# Altium schematic sheet MAKKI_ISMAIL_ESPS3_CAM_0.SchDoc: MAKKI_ISMAIL_ESPS3_CAM
size 370 x 255 mm; COMPANY: ADAFRUIT INDUSTRIES; DRAWN: KTOWN; REV: B; Origin: Eagle; OriginPath: C:\Users\aliam\OneDrive\Desktop\MAKKI_ISMAIL_ESPS3_CAM\MAKKI_ISMAIL_ESPS3_CAM\MAKKI_ISMAIL_ESPS3_CAM.sch; OriginSheet: 1; Date: 1/28/2026 8:50:00 AM; SheetNumber: 1; GateName_1: G$1; SymbolName_1: A4L-LOC; LibraryName: frames; DeviceSetName: A4L-LOC; Sheet: Sheet:
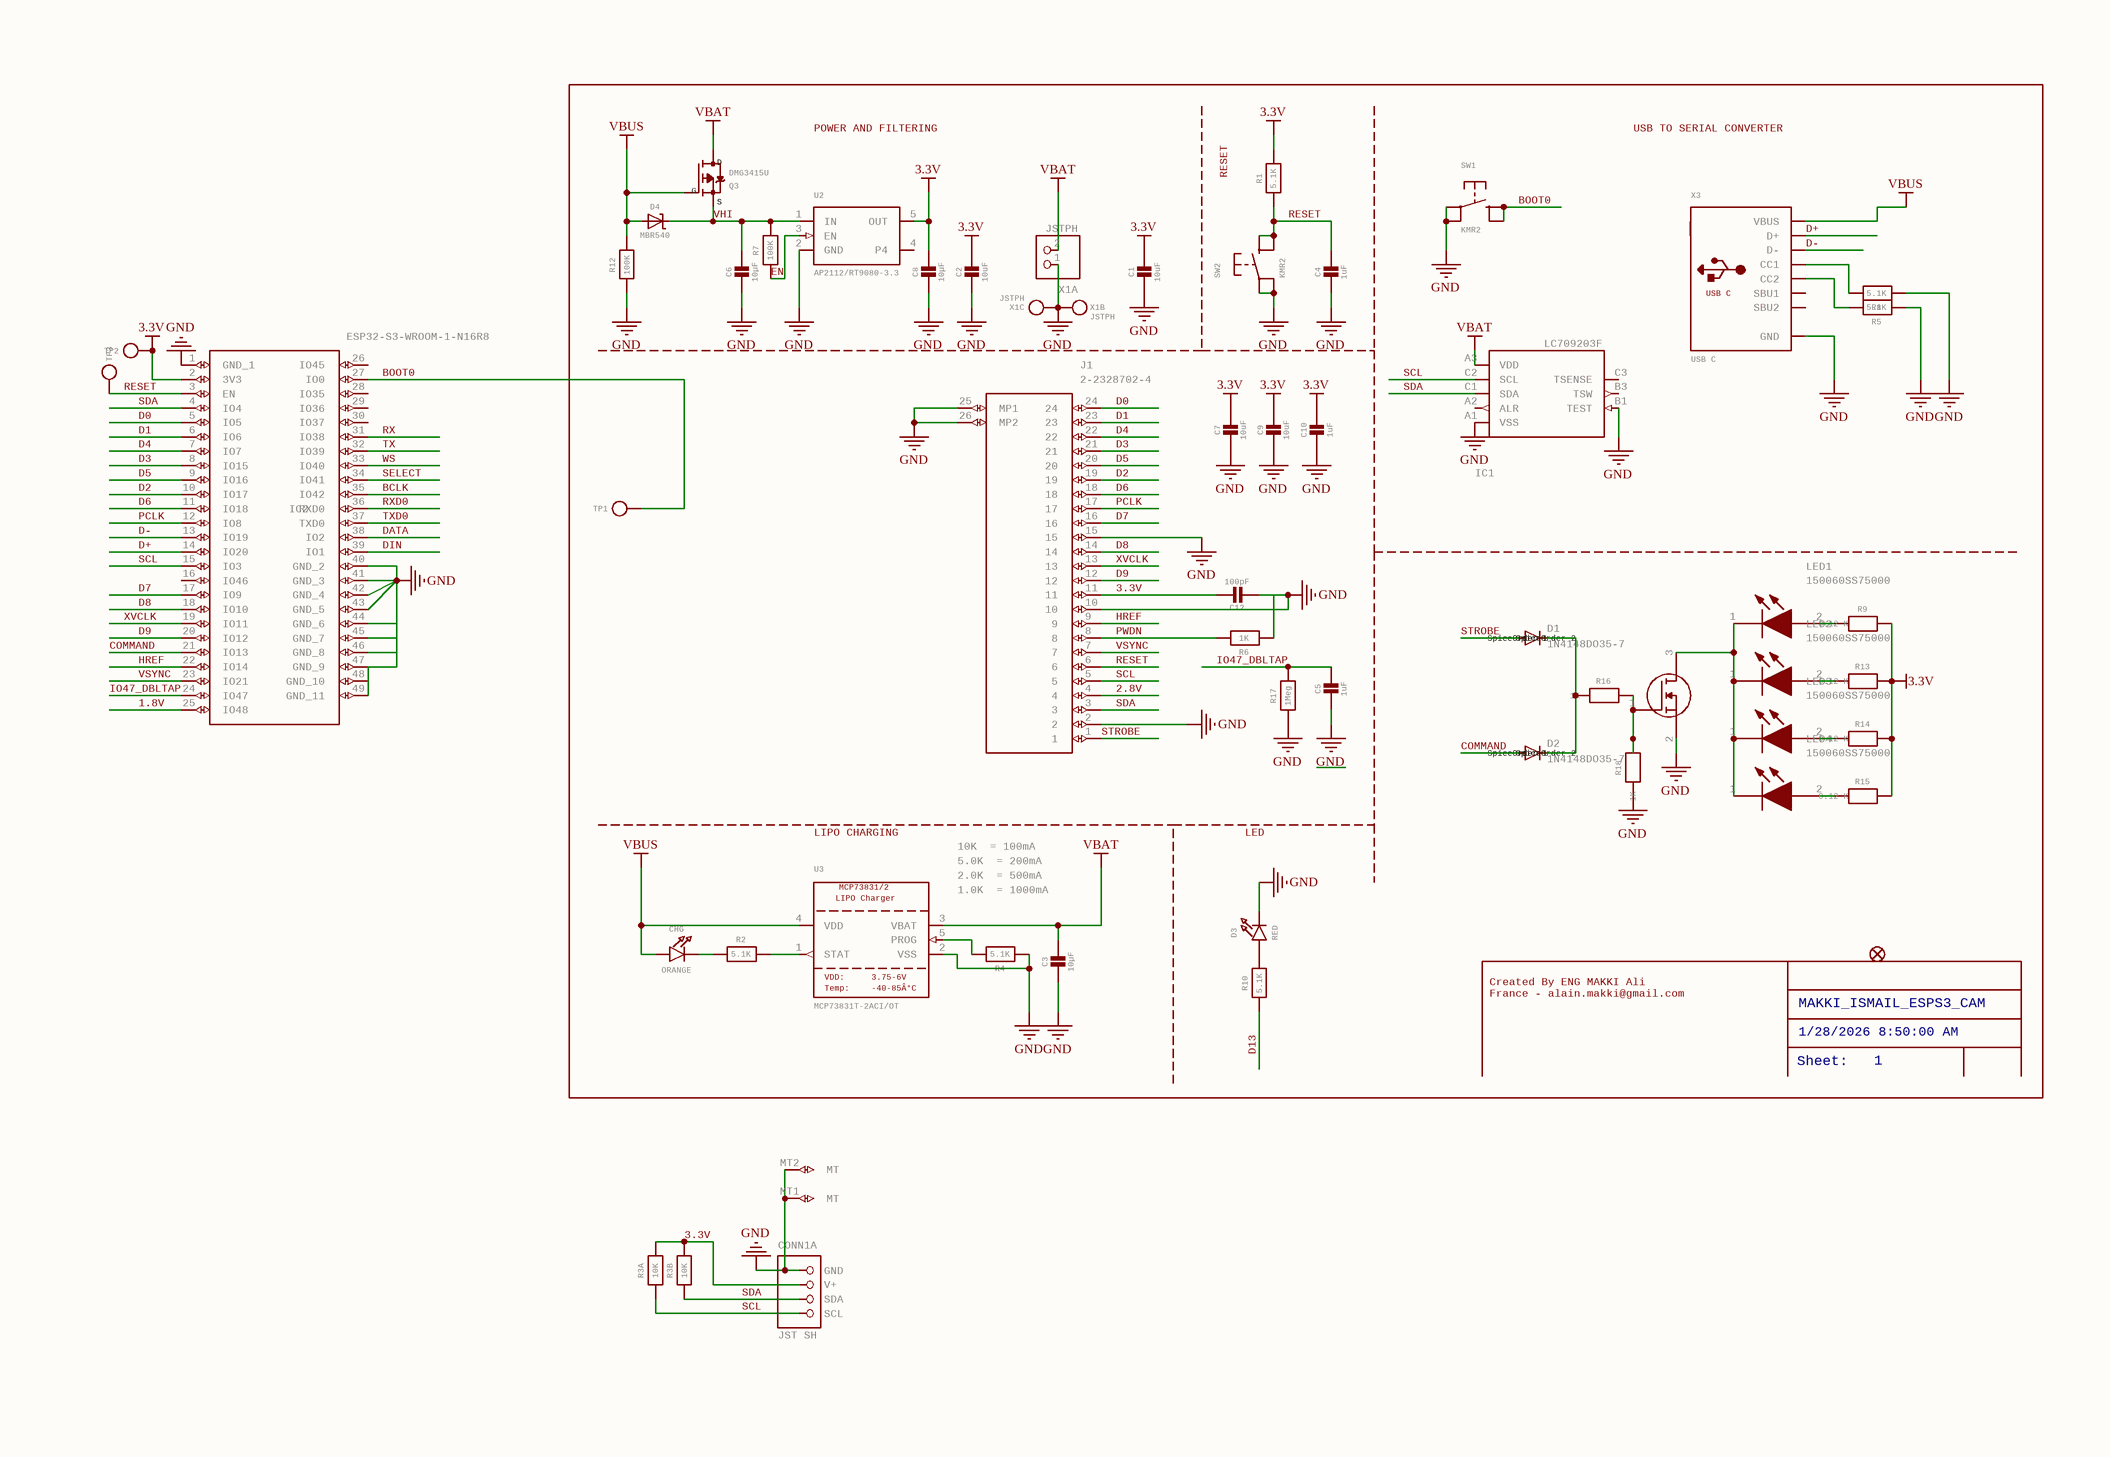
[diagram p0: MAKKI_ISMAIL_ESPS3_CAM_0.SchDoc]

## Parts
C1  10uF  [0805-NO]
C2  10uF  [0805-NO]
C3  10µF  [0805-NO]
C4  1uF  [0603-NO]
C5  1uF  [0603-NO]
C6  10µF  [0805-NO]
C7  10uF  [0805-NO]
C8  10µF  [0805-NO]
C9  10uF  [0805-NO]
C10  1uF  [0603-NO]
C12  100pF  [0805-NO]
CHG  ORANGE  [CHIPLED_0603_NOOUTLINE]
CONN1  JST SH  [JST_SH4_RA]  (parts A,B,C of 3)
D1  1N4148DO35-7  SpiceOrder1: SpiceOrder 1  SpiceOrder2: SpiceOrder 2  [DO35-7]
D2  1N4148DO35-7  SpiceOrder1: SpiceOrder 1  SpiceOrder2: SpiceOrder 2  [DO35-7]
D3  RED  [CHIPLED_0603_NOOUTLINE]
D4  MBR540  [SOD-123]
IC1  LC709203F/MH  [WLCSP9]  (value not drawn)
IC2  ESP32-S3-WROOM-1-N16R8  [ESP32S3WROOM1N16R8]
J1  2-2328702-4  [223287024]
LED1  150060SS75000  [LEDC1608X80N]
LED2  150060SS75000  [LEDC1608X80N]
LED3  150060SS75000  [LEDC1608X80N]
LED4  150060SS75000  [LEDC1608X80N]
Q2  2N7002  [SOT96P240X120-3N]  (value not drawn)
Q3  DMG3415U  [SOT23-R]
R1  5.1K  [0603-NO]
R2  5.1K  [0603-NO]
R3  10K  [RESPACK_4X0603]  (parts A,B of 4)
R4  5.1K  [0603-NO]
R5  5.1K  [0603-NO]
R6  1K  [0603-NO]
R7  100K  [0603-NO]
R8  5.1K  [0603-NO]
R9  0.12 K  [0603-NO]
R10  5.1K  [0603-NO]
R12  100K  [0603-NO]
R13  0.12 K  [0603-NO]
R14  0.12 K  [0603-NO]
R15  0.12 K  [0603-NO]
R16  1K  [0603-NO]
R17  1Meg  [0603-NO]
R18  1K  [0603-NO]
SW1  KMR2  [BTN_KMR2_4.6X2.8]
SW2  KMR2  [BTN_KMR2_4.6X2.8]
TP1  TESTPOINTROUND1.5MMNO  [TESTPOINT_ROUND_1.5MM_NO]  (value not drawn)
TP2  TESTPOINTROUND1.5MMNO  [TESTPOINT_ROUND_1.5MM_NO]  (value not drawn)
TP3  TESTPOINTROUND1.5MMNO  [TESTPOINT_ROUND_1.5MM_NO]  (value not drawn)
U2  AP2112/RT9080-3.3  [SOT23-5]
U3  MCP73831T-2ACI/OT  LIPOCharger: LIPO Charger  Temp: Temp:  VDD: VDD:  [SOT23-5]
U$34  FIDUCIAL_1MM  [FIDUCIAL_1MM]  (value not drawn)
X1  JSTPH  [JSTPH2_BATT]  (parts A,B,C of 3)
X3  USB C  [USB_C_CUSB31-CFM2AX-01-X]

## Nets
3.3V: C1.1 C2.1 C7.1 C8.1 C9.1 C10.1 C12.1 CONN1.2(V+) IC2.2(3V3) J1.11 R1.2 R3.7 R3.8 R9.2 R13.2 R14.2 R15.2 TP2.P$1 U2.5(OUT)
GND: C1.2 C2.2 C3.2 C4.2 C5.2 C6.2 C7.2 C8.2 C9.2 C10.2 C12.2 CONN1.1(GND) CONN1.MT1(MT) CONN1.MT2(MT) D3.C IC1.A1(VSS) IC1.B1(TEST) IC2.1(GND_1) IC2.40(GND_2) IC2.41(GND_3) IC2.42(GND_4) IC2.43(GND_5) IC2.44(GND_6) IC2.45(GND_7) IC2.46(GND_8) IC2.47(GND_9) IC2.48(GND_10) IC2.49(GND_11) J1.2 J1.10 J1.15 J1.25(MP1) J1.26(MP2) Q2.2(S) R4.1 R5.1 R6.1 R8.1 R12.1 R17.1 R18.1 SW1.A(P) SW1.A'(P1) SW2.A(P) SW2.A'(P1) U2.2(GND) U3.2(VSS) X1.1 X1.NC1(P$1) X1.NC2(P$1) X3.A1B12,B1A12(GND)
VBAT: C3.1 IC1.A3(VDD) Q3.3(D) U3.3(VBAT) X1.2
VBUS: CHG.A D4.A Q3.1(G) R12.2 U3.4(VDD) X3.A4B9,B4A9(VBUS)
1.8V: IC2.25(IO48)
2.8V: J1.4
BCLK: IC2.35(IO42)
BOOT0: IC2.27(IO0) SW1.B(S) SW1.B'(S1) TP1.P$1
COMMAND: D2.A IC2.21(IO13)
D0: IC2.5(IO5) J1.24
D1: IC2.6(IO6) J1.23
D2: IC2.10(IO17) J1.19
D3: IC2.8(IO15) J1.21
D4: IC2.7(IO7) J1.22
D5: IC2.9(IO16) J1.20
D6: IC2.11(IO18) J1.18
D7: IC2.17(IO9) J1.16
D8: IC2.18(IO10) J1.14
D9: IC2.20(IO12) J1.12
D13: R10.1
D+: IC2.14(IO20) X3.A6,B6(D+)
D-: IC2.13(IO19) X3.A7,B7(D-)
DATA: IC2.38(IO2)
DIN: IC2.39(IO1)
EN: R7.1 U2.3(EN)
HREF: IC2.22(IO14) J1.9
IO47_DBLTAP: C5.1 IC2.24(IO47) R17.2
PCLK: IC2.12(IO8) J1.17
PWDN: J1.8 R6.2
RESET: C4.1 IC2.3(EN) J1.6 R1.1 SW2.B(S) SW2.B'(S1) TP3.P$1
RX: IC2.31(IO38)
RXD0: IC2.36(RXD0)
SCL: CONN1.4(SCL) IC1.C2(SCL) IC2.15(IO3) J1.5 R3.1
SDA: CONN1.3(SDA) IC1.C1(SDA) IC2.4(IO4) J1.3 R3.2
SELECT: IC2.34(IO41)
STROBE: D1.A J1.1
TX: IC2.32(IO39)
TXD0: IC2.37(TXD0)
VHI: C6.1 D4.C Q3.2(S) R7.2 U2.1(IN)
VSYNC: IC2.23(IO21) J1.7
WS: IC2.33(IO40)
XVCLK: IC2.19(IO11) J1.13
NetCHG_C: CHG.C R2.1
NetD1_C: D1.C D2.C R16.1
NetD3_A: D3.A R10.2
NetLED1_1: LED1.1(K) LED2.1(K) LED3.1(K) LED4.1(K) Q2.3(D)
NetLED1_2: LED1.2(A) R9.1
NetLED2_2: LED2.2(A) R13.1
NetLED3_2: LED3.2(A) R14.1
NetLED4_2: LED4.2(A) R15.1
NetQ2_1: Q2.1(G) R16.2 R18.2
NetR2_2: R2.2 U3.1(STAT)
NetR4_2: R4.2 U3.5(PROG)
NetR5_2: R5.2 X3.B5(CC2)
NetR8_2: R8.2 X3.A5(CC1)

Not connected (* = marked no-connect by the designer): IC1 A2(ALR) B3(TSW) C3(TSENSE); IC2 16(IO46) 26(IO45) 28(IO35) 29(IO36) 30(IO37); U2 4(P4); X3 A8(SBU1) B8(SBU2)

## Notes on the sheet
- POWER AND FILTERING
- (near R1) RESET
- USB TO SERIAL CONVERTER
- LIPO CHARGING
- LED
- 10K  = 100mA
- 5.0K  = 200mA
- 2.0K  = 500mA
- 1.0K  = 1000mA
- Created By ENG MAKKI Ali
  France - alain.makki@gmail.com
- (near U$34) MAKKI_ISMAIL_ESPS3_CAM
- 1/28/2026 8:50:00 AM
- Sheet:
- 1

## Library data of the parts
C1-C3 C6-C9 C12 = CAP_CERAMIC0805-NOOUTLINE: Ceramic Capacitors   For new designs, use the packages preceded by an '_' character since they are more reliable:   The following footprints should be used on most boards: _0402 - Standard footprint for regular board layouts  _0603 - Standard footprint for regular board layouts  _0805 - Standard footprint for regular board layouts  _1206 - Standard footprint for regular board layouts       For extremely tight-pitch boards where space is at a premium, the following 'micro-pitch' footprints can be used (smaller pads, no silkscreen outline, etc.): _0402MP - Micro-pitch footprint for very dense/compact boards  _0603MP - Micro-pitch footprint for very dense/compact boards  _0805MP - Micro-pitch footprint for very dense/compact boards  _1206MP - Micro-pitch footprint for very dense/compact boards; GateName_1: G$1; SymbolName_1: CAPACITOR; DeviceName: 0805-NOOUTLINE; LibraryName: microbuilder; DeviceSetName: CAP_CERAMIC
  C8: REV: C
C4 C5 C10 = CAP_CERAMIC0603_NO: Ceramic Capacitors   For new designs, use the packages preceded by an '_' character since they are more reliable:   The following footprints should be used on most boards: _0402 - Standard footprint for regular board layouts  _0603 - Standard footprint for regular board layouts  _0805 - Standard footprint for regular board layouts  _1206 - Standard footprint for regular board layouts       For extremely tight-pitch boards where space is at a premium, the following 'micro-pitch' footprints can be used (smaller pads, no silkscreen outline, etc.): _0402MP - Micro-pitch footprint for very dense/compact boards  _0603MP - Micro-pitch footprint for very dense/compact boards  _0805MP - Micro-pitch footprint for very dense/compact boards  _1206MP - Micro-pitch footprint for very dense/compact boards; GateName_1: G$1; SymbolName_1: CAPACITOR; DeviceName: 0603_NO; LibraryName: microbuilder; DeviceSetName: CAP_CERAMIC
CHG D3 = LED0603_NOOUTLINE: LED0603 - 0603 Surface Mount Package    2mA: Green LED - Low Power (3.9mcd, 2ma, 1.7Vf) - Digikey: 475-2709-2-ND  Orange LED - Low Power (9.8mcd, 2ma, 1.8Vf) - Digikey: 475-1194-2-ND  Red LED - Low Power (5mcd, 2ma, 1.8Vf) - Digikey: 475-1195-2-ND  Yellow LED - Low Power (7mcd, 2ma, 1.8Vf) - Digikey: 475-1196-2-ND       5mA: Blue LED - Low Power (17mcd, 5ma, 2.9Vf) - Digikey: LNJ937W8CRACT-ND    0805 - 0805 Surface Mount Package    2mA: Red LED (8.8mcd, 2mA, 1.8Vf, Clear) - Low Power [Digikey: 475-2510-1-ND]  Green LED (5mcd, 2mA, 1.8Vf, Clear) - Low Power [Digikey: 475-2730-1-ND]  Yellow LED (11.3mcd, 2mA, 1.8Vf, Clear) - Low Power [Digikey: 475-2555-1-ND]       20mA: Red LED (104mcd, 20mA, Diffused) - LS R976 [Digikey: 475-1278-6-ND]  Red LED (12mcd, 20mA, 2.0Vf, Clear) - APT2012EC [Digikey: 754-1128-1-ND]  Green LED (15mcd, 20mA, 2.2Vf, Clear) - APT2012GC [Digikey: 754-1131-1-ND]  Orange LED (160mcd, 20mA, 2.1Vf, Clear) - APT2012SECK [Digikey: 754-1130-1-ND]     1206 - 1206 Surface Mount Package  Green LED (26mcd, 20mA, Diffused) - LG N971  [Digikey: 475-1407-6-ND]  Red LED (15mcd, 20mA, Diffused) - LH N974 [Digikey: 475-1416-6-ND]     Cree - Cree High-Power Surface Mount LEDs  XPEBWT-L1-0000-00D50 - White 111lm 350mA 2.9Vf 6200K 110Â°  XTEAWT-00-0000-00000LEE3 - White 114lm 350mA 2.85Vf 5000K 115Â°     Everlight - Everlight 45-21 Series Surface Mount LEDs  45-21/QK2C-B2832AC2CB2/2T - Warm White 2000mcd 20mA 3.25Vf 3050K 120Â°  45-21/LK2C-B38452C4CB2/2T - Nuetral White 2000mcd 20mA 3.25Vf 4150K 120Â°  45-21/LK2C-B50634C6CB2/2T - Cold White 2200mcd 20mA 3.25Vf 5650K 120Â°     PLCC2 Reverse Mount LS T77K-J1L2-1-0-2-R18-Z - Red 11.25mcd 2mA 1.8Vf 630nm 120Â°  LO T77K-L1M2-24-Z - Orange 19.6mcd 2mA 1.8Vf 606nm 120Â°  LY T77K-K2M1-26-Z - Yellow 15.7mcd 2mA 1.8Vf 587nm 120Â°; GateName_1: G$1; SymbolName_1: LED; DeviceName: 0603_NOOUTLINE; LibraryName: microbuilder; DeviceSetName: LED
CONN1 = STEMMA_I2C_QTRA: GateName_1: G$1; GateName_2: G$2; SymbolName_2: MOUNTING; GateName_3: G$3; DeviceName: _QTRA; SymbolName_1: STEMMA_I2C; SymbolName_3: MOUNTING; LibraryName: microbuilder; DeviceSetName: STEMMA_I2C
D1 D2 = 1N4148DO35-7: DIODE   high speed (Philips); GateName_1: G$1; SymbolName_1: D; DeviceSetName: 1N4148; POPULARITY: 58; DeviceName: DO35-7; LibraryName: diode
D4 = DIODE-SCHOTTKYSOD-123: GateName_1: G$1; SymbolName_1: DIODE-SCHOTTKY; DeviceName: SOD-123; LibraryName: microbuilder; DeviceSetName: DIODE-SCHOTTKY
IC1 = LC709203F/MH: GateName_1: G$1; DeviceName: /MH; SymbolName_1: LC709203F; LibraryName: adafruit_sensor; DeviceSetName: LC709203F; LC709203F: LC709203F
IC2 = ESP32-S3-WROOM-1-N16R8: Multiprotocol Modules SMD Module, ESP32-S3R8, 3.3V, 8 MB Octal PSRAM Die, 16 MB Quad SPI Flash, PCB Antenna   Source:  Datasheet; MANUFACTURER_NAME: Espressif Systems; GateName_1: G$1; SymbolName_1: ESP32-S3-WROOM-1-N16R8; LibraryName: SamacSys_Parts; DeviceSetName: ESP32-S3-WROOM-1-N16R8; DESCRIPTION: Multiprotocol Modules SMD Module, ESP32-S3R8, 3.3V, 8 MB Octal PSRAM Die, 16 MB Quad SPI Flash, PCB Antenna; HEIGHT: 3.25mm; MANUFACTURER_PART_NUMBER: ESP32-S3-WROOM-1-N16R8; MOUSER_PART_NUMBER: 356-ESP32S3WRM1N16R8; MOUSER_PRICE-STOCK: https://www.mouser.co.uk/ProductDetail/Espressif-Systems/ESP32-S3-WROOM-1-N16R8?qs=Li%252BoUPsLEnvQc9gW6AMhZg%3D%3D
J1 = 2-2328702-4: 24 Position FPC Connector Contacts, Top and Bottom 0.020" (0.50mm) Surface Mount, Right Angle   Source:  Datasheet; MANUFACTURER_NAME: TE Connectivity; GateName_1: G$1; SymbolName_1: 2-2328702-4; LibraryName: SamacSys_Parts; DeviceSetName: 2-2328702-4; DESCRIPTION: 24 Position FPC Connector Contacts, Top and Bottom 0.020" (0.50mm) Surface Mount, Right Angle; HEIGHT: 1.21mm; MANUFACTURER_PART_NUMBER: 2-2328702-4; MOUSER_PART_NUMBER: 571-2-2328702-4; MOUSER_PRICE-STOCK: https://www.mouser.co.uk/ProductDetail/TE-Connectivity/2-2328702-4?qs=P1JMDcb91o4XHtVyXYd2Ug%3D%3D
LED1-LED4 = 150060SS75000: WL-SMCW SMT Mono-Color Chip LED Waterclear 0603, Super Red Typ.(@20mA): 630nm, 60mcd, 1.9V, 140 AlInGaP   Source:  Datasheet; MANUFACTURER_NAME: Wurth Elektronik; GateName_1: G$1; SymbolName_1: 150060SS75000; LibraryName: SamacSys_Parts; DeviceSetName: 150060SS75000; DESCRIPTION: WL-SMCW SMT Mono-Color Chip LED Waterclear 0603, Super Red Typ.(; HEIGHT: 0.8mm; MANUFACTURER_PART_NUMBER: 150060SS75000; MOUSER_PART_NUMBER: 710-150060SS75000; MOUSER_PRICE-STOCK: https://www.mouser.co.uk/ProductDetail/Wurth-Elektronik/150060SS75000?qs=LlUlMxKIyB0oQaxwspeTEA%3D%3D
Q2 = 2N7002: Voltage controlled small signal switch.; High density cell design for extremely low RDS(ON).; Rugged and Reliable.; High saturation current capability.   Source:  Datasheet; MANUFACTURER_NAME: onsemi; GateName_1: G$1; SymbolName_1: 2N7002; LibraryName: SamacSys_Parts; DeviceSetName: 2N7002; DESCRIPTION: Voltage controlled small signal switch.; High density cell design for extremely low RDS(ON).; Rugged and Reliable.; High saturation current capability.; HEIGHT: 1.2mm; MANUFACTURER_PART_NUMBER: 2N7002; MOUSER_PART_NUMBER: 512-2N7002; MOUSER_PRICE-STOCK: https://www.mouser.co.uk/ProductDetail/onsemi-Fairchild/2N7002?qs=0dwsXDNhqlz66WJJhrTFjQ%3D%3D
Q3 = MOSFET-P: P-Channel Mosfet   LEGEND   VDS: Voltage Drain-Source ID: Drain Current RDS(ON): Drain-Source On-State Resistance VGS(TH): Gate-Source Threshold Voltage CISS: Drain-Source Input Capacitance    SOT-23   Name	VDS	ID	RDS(ON)	VGS(TH)	CISS	Order Number	   IRLML5103	30V	760mA	600 mOhm	--	75pF @ 25V	Digikey: IRLML5103PBFCT-ND	   IRLML6401	12V	4.3A	50 mOhm	950mV @ 250ÂµA	830pF @ 10V	Digikey: IRLML6401PBFTR-ND	   NTR0202PL	20V	400mA	800 mOhm	2.3V @ 250uA	70pF @ 5V	Digikey: NTR0202PLT1GOSTR-ND	   NTR4101PT1G	20V	1.8A	85 mOhm	1.2V @ 250uA	675pF @ 10V	Digikey: NTR4101PT1GOSCT-ND	   DMP2004K	20V	600mA	900 mOhm	1V @ 250uA	175pF @ 16V	Digikey: DMP2004KDICT-ND	   PMV65XP	20V	3.9A	76 mOhm	950mV @ 1mA	725pF @ 20V	Digikey: 568-2358-2-ND	   							   							TO-252   Name	VDS	ID	RDS(ON)	VGS(TH)	CISS	Order Number	   AOD417	30V	25A	34 mOhm	3V @ 250ÂµA	920pF @ 15V	Digikey: 785-1106-2-ND	PowerPak   Name	VDS	ID	RDS(ON)	VGS(TH)	CISS	Order Number	   AON7401	30V	12A	14 mOhm	3V @ 250ÂµA	2600pF @ 15V	Digikey: 785-1302-1-ND; GateName_1: G$1; SymbolName_1: MOSFET-P; LibraryName: microbuilder; DeviceSetName: MOSFET-P; D: D; S: S; G: G
R1 R2 R4-R10 R12-R18 = RESISTOR_0603_NOOUT: Resistors   For new designs, use the packages preceded by an '_' character since they are more reliable:   The following footprints should be used on most boards: _0402 - Standard footprint for regular board layouts  _0603 - Standard footprint for regular board layouts  _0805 - Standard footprint for regular board layouts  _1206 - Standard footprint for regular board layouts       For extremely tight-pitch boards where space is at a premium, the following 'micro-pitch' footprints can be used (smaller pads, no silkscreen outline, etc.): _0402MP - Micro-pitch footprint for very dense/compact boards  _0603MP - Micro-pitch footprint for very dense/compact boards  _0805MP - Micro-pitch footprint for very dense/compact boards  _1206MP - Micro-pitch footprint for very dense/compact boards; GateName_1: G$1; SymbolName_1: RESISTOR; DeviceName: _0603_NOOUT; LibraryName: microbuilder; DeviceSetName: RESISTOR
R3 = RESISTOR_4PACK: Resistor Packs (4 resistors)   4 x 0603 10K 1/16W - Digikey: YC164J-10KCT-ND; GateName_1: G$1; GateName_2: G$2; GateName_3: G$3; GateName_4: G$4; SymbolName_1: RESISTOR; SymbolName_2: RESISTOR; SymbolName_3: RESISTOR; SymbolName_4: RESISTOR; LibraryName: microbuilder; DeviceSetName: RESISTOR_4PACK
SW1 SW2 = SWITCH_TACT_SMT4.6X2.8: SMT Tact Switches 6x6mm - Digikey: P12940SCT-ND  KMR2 (4.6x2.8mm) - Digikey: 401-1426-1-ND  EVQ-PQHB55 - Light Touch, 160GF (4.5x4.5mm) - Digikey: P8090SCT-ND  KMT0 - KMT021 NGJ LHS (etc.) IP68/Waterproof - Digikey: CKN10289CT-ND; GateName_1: G$1; SymbolName_1: BUTTON_4PIN; DeviceName: 4.6X2.8; LibraryName: microbuilder; DeviceSetName: SWITCH_TACT_SMT
TP1-TP3 = TESTPOINTROUND1.5MMNO: Test Point   Various test points for characterisation and PCB testing    TESTPOINT_SMT - Compact Surface Mount Test Point [Digikey: 5016KTR-ND]; GateName_1: G$1; SymbolName_1: TESTPOINT; DeviceName: ROUND1.5MMNO; LibraryName: microbuilder; DeviceSetName: TESTPOINT
U2 = VREG_SOT23-5: SOT23-5 Fixed Voltage Regulators      Part	Current Out	V Out	V In	V Dropout	Î¸JA (Â°C/W)	TJ (Â°C)	Digikey Part No.	     ADP121	  150mA	  3.3V	  3.4-5.5V	  0.09V @ 150mA	  --	  --	  ADP121-AUJZ33R7CT-ND	     ADP121	  150mA	  3.0V	  3.1-5.5V	  0.09V @ 150mA	  --	  --	  ADP121-AUJZ30R7CT-ND	     ADP122	  300mA	  3.3V	  3.4-5.5V	  0.085V @ 300mA	  --	  --	  ADP122AUJZ-3.3-R7CT-ND	     ADP1712	  300mA	  3.3V	  3.5-5.5V	  0.17V @ 300mA	  --	  --	  ADP1712AUJZ-3.3-R7TR-ND	     AP7311 (Low Cost)	  150mA	  3.3V	  3.5-6V	  0.15V @ 150mA	  --	  --	  AP7311-33WG-7DICT-ND	     LD39015M18R	  150mA	  1.8V	  1.9V-5.5V	  0.08V @ 100mA	  --	  --	  497-6977-1-ND	     LP2985A-33DBVR	  150mA	  3.3V	  3.3-16V	  0.28V @ 150mA	  206	  150	  296-18479-1-ND	     MCP1824T-3302E/OT	  300mA	  3.3V	  3.5V-6V	  0.2V @ 300mA	  --	  --	  MCP1824T-3302E/OTCT-ND	     MIC5205-2.5YM5 TR	  150mA	  2.5V	  2.7-16V	  0.165V @ 150mA	  --	  --	  576-1257-2-ND	     MIC5205-3.0YM5 TR	  150mA	  3.0V	  3.2V-16V	  0.165V @ 150mA	  --	  --	  576-1258-2-ND	     MIC5205-3.3YM5 TR	  150mA	  3.3V	  3.5V-16V	  0.165V @ 150mA	  --	  --	  576-1259-2-ND	     TPS780330220	  150mA	  3.3V+2.2V	  3.6-5.5V	  250mV Max	  --	  --	  296-23332-1-ND	     TDA3663/N1,135	  100mA	  3.3V	  3.5-45V	  0.18V @ 50mA	  --	  --	  568-5343-1-ND	     	  	  	  	  	  	  	  	     	  	  	  	  	  	  	  	   Max operating temp can be calculated using Î¸JA, TJ (max junction temperature), and power in watts.  Set the "Maximum Ambient Temperature" until it reaches TJ ("Max Junction Temperature"), which is the absolute limit for safe use of the regulator: Heat Sink Temperature Calculator   For example, With 12V source into a 3.3V LP2985 and a 30mA load, we are dissipating (12V-3.3V) * 0.03A = 0.261W.  With a Î¸JA of 206 Â°C/W, a TJ of 150Â°C, and 261mW we can safely use the chip without a heat sink up to 75Â°C (=147.1Â°C Junction Temperature).; GateName_1: G$1; SymbolName_1: VREG_SOT23-5; LibraryName: microbuilder; DeviceSetName: VREG_SOT23-5
U3 = MCP73831/2: MCP73831/2 LIPO Charger    VDD: 3.75 - 6V  Temp -40 - 85Â°C  Programmable Charge Rate: 15-500mA       NOTE: STAT is a tri-state logic output on the MCP73831 and an open-drain output on the MCP73832.   SOT23-5 with 4.2V output and tri-state logic on STAT = MCP73831T-2ACI/OT; GateName_1: G$1; SymbolName_1: MCP73831/2; LibraryName: microbuilder; DeviceSetName: MCP73831/2; MCP73831/2: MCP73831/2; -40-85Â°C: -40-85Â°C; 3.75-6V: 3.75-6V
U$34 = FIDUCIAL_1MM: Fiducial Alignment Points   Various fiducial points for machine vision alignment.; GateName_1: G$1; DeviceName: _1MM; BOM: EXCLUDE; SymbolName_1: FIDUCIAL; LibraryName: microbuilder; DeviceSetName: FIDUCIAL
X1 = CON_JST_PH_2PIN_MT_BATT: GateName_1: G$1; SymbolName_1: PINHD2; GateName_2: MT2; SymbolName_2: TESTPOINT; GateName_3: MT1; DeviceName: _BATT; SymbolName_3: TESTPOINT; LibraryName: adafruit_electromech; DeviceSetName: CON_JST_PH_2PIN_MT
X3 = USB_C: USB Type-C USB 2.0 Connector; GateName_1: G$1; SymbolName_1: USB_C; LibraryName: adafruit_connector; DeviceSetName: USB_C; USBC: USB C